# Altium schematic sheet 06-SNESDRONE_Direct_IO_ARTY_Z7.SchDoc
size A
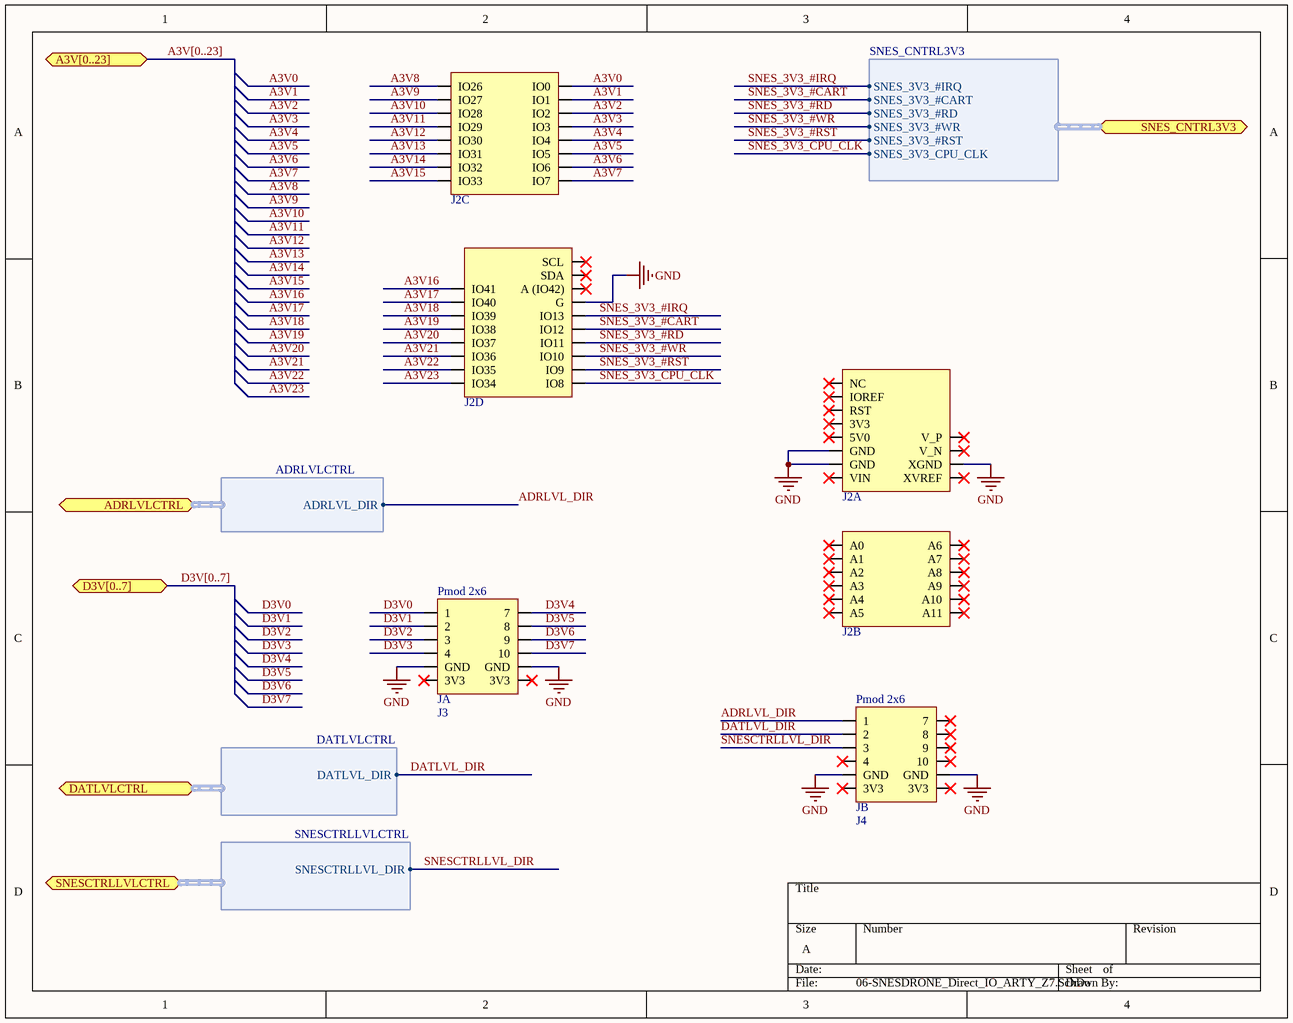
[diagram p0: 06-SNESDRONE_Direct_IO_ARTY_Z7.SchDoc]

## Parts
J2  ARTY_Z7  [arty-z7]  (value not drawn)  (parts A,B,C,D of 4)  (no BOM)
J3  ARTY_Z7_PMOD_A  [arty-z7-pmod]  (value not drawn)  (no BOM)
J4  ARTY_Z7_PMOD_B  [arty-z7-pmod]  (value not drawn)  (no BOM)

## Ports
A3V[0..23] (bidir), ADRLVLCTRL (bidir, harness ADRLVLCTRL), D3V[0..7] (bidir), DATLVLCTRL (bidir, harness DATLVLCTRL), SNES_CNTRL3V3 (bidir, harness SNES_CNTRL3V3), SNESCTRLLVLCTRL (bidir, harness SNESCTRLLVLCTRL)

## Harnesses
DATLVLCTRL: DATLVL_DIR
SNES_CNTRL3V3: SNES_3V3_#IRQ, SNES_3V3_#CART, SNES_3V3_#RD, SNES_3V3_#WR, SNES_3V3_#RST, SNES_3V3_CPU_CLK
SNESCTRLLVLCTRL: SNESCTRLLVL_DIR
ADRLVLCTRL: ADRLVL_DIR

## Nets
GND: J2.5(GND) J2.6(GND) J2.9(XGND) J2.54(G) J3.4(GND) J3.7(GND) J4.4(GND) J4.7(GND)
A3V0: J2.32(IO0)
A3V1: J2.33(IO1)
A3V2: J2.34(IO2)
A3V3: J2.35(IO3)
A3V4: J2.36(IO4)
A3V5: J2.37(IO5)
A3V6: J2.38(IO6)
A3V7: J2.39(IO7)
A3V8: J2.31(IO26)
A3V9: J2.30(IO27)
A3V10: J2.29(IO28)
A3V11: J2.28(IO29)
A3V12: J2.27(IO30)
A3V13: J2.26(IO31)
A3V14: J2.25(IO32)
A3V15: J2.24(IO33)
A3V16: J2.40(IO41)
A3V17: J2.41(IO40)
A3V18: J2.42(IO39)
A3V19: J2.43(IO38)
A3V20: J2.44(IO37)
A3V21: J2.45(IO36)
A3V22: J2.46(IO35)
A3V23: J2.47(IO34)
ADRLVL_DIR: J4.0(1) ; port ADRLVLCTRL.ADRLVL_DIR
D3V0: J3.0(1)
D3V1: J3.1(2)
D3V2: J3.2(3)
D3V3: J3.3(4)
D3V4: J3.11(7)
D3V5: J3.10(8)
D3V6: J3.9
D3V7: J3.8(10)
DATLVL_DIR: J4.1(2) ; port DATLVLCTRL.DATLVL_DIR
SNES_3V3_#CART: J2.52(IO12) ; port SNES_CNTRL3V3.SNES_3V3_#CART
SNES_3V3_#IRQ: J2.53(IO13) ; port SNES_CNTRL3V3.SNES_3V3_#IRQ
SNES_3V3_#RD: J2.51(IO11) ; port SNES_CNTRL3V3.SNES_3V3_#RD
SNES_3V3_#RST: J2.49(IO9) ; port SNES_CNTRL3V3.SNES_3V3_#RST
SNES_3V3_#WR: J2.50(IO10) ; port SNES_CNTRL3V3.SNES_3V3_#WR
SNES_3V3_CPU_CLK: J2.48(IO8) ; port SNES_CNTRL3V3.SNES_3V3_CPU_CLK
SNESCTRLLVL_DIR: J4.2(3) ; port SNESCTRLLVLCTRL.SNESCTRLLVL_DIR

Not connected (* = marked no-connect by the designer): J2 0(NC)* 1(IOREF)* 2(RST)* 3(3V3)* 4(5V0)* 7(VIN)* 8(XVREF)* 10(V_N)* 11(V_P)* 12(A0)* 13(A1)* 14(A2)* 15(A3)* 16(A4)* 17(A5)* 18(A11)* 19(A10)* 20(A9)* 21(A8)* 22(A7)* 23(A6)* 55(A_(IO42))* 56(SDA)* 57(SCL)*; J3 5(3V3)* 6(3V3)*; J4 3(4)* 5(3V3)* 6(3V3)* 8(10)* 9* 10(8)* 11(7)*

## Buses and harness runs
bus A3V[0..23] = port A3V[0..23]
bus D3V[0..7] = port D3V[0..7]

## Notes on the sheet
- (in symbol ARTY_Z7_PMOD_A) Pmod 2x6; JA
- (in symbol ARTY_Z7_PMOD_B) Pmod 2x6; JB

## Library data of the parts
J2 = ARTY_Z7: Connections to Arty Z7 SoC Board
J3 = ARTY_Z7_PMOD_A: Connections to Arty Z7 SoC Board
J4 = ARTY_Z7_PMOD_B: Connections to Arty Z7 SoC Board